# Altium schematic sheet USER_INTERFACE_input.SchDoc
size A; SheetNumber: 18; SheetTotal: 31
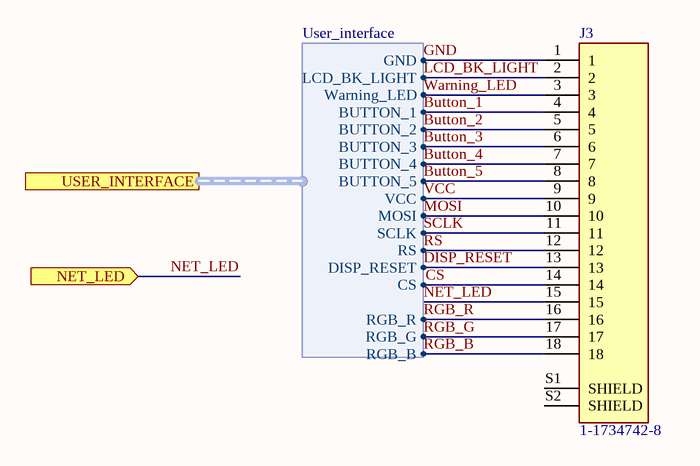
[diagram p0: USER_INTERFACE_input.SchDoc]

## Parts
J3  1-1734742-8  [FPC_SMD_18P_P0.5_vertical]

## Ports
NET_LED (in), USER_INTERFACE (harness User_interface)

## Harnesses
User_interface: GND, BUTTON_1, BUTTON_2, BUTTON_3, BUTTON_4, BUTTON_5, VCC, MOSI, SCLK, RS, DISP_RESET, CS, LCD_BK_LIGHT, Warning_LED, RGB_R, RGB_G, RGB_B

## Nets
Button_1: J3.4 ; port USER_INTERFACE.BUTTON_1
Button_2: J3.5 ; port USER_INTERFACE.BUTTON_2
Button_3: J3.6 ; port USER_INTERFACE.BUTTON_3
Button_4: J3.7 ; port USER_INTERFACE.BUTTON_4
Button_5: J3.8 ; port USER_INTERFACE.BUTTON_5
CS: J3.14 ; port USER_INTERFACE.CS
DISP_RESET: J3.13 ; port USER_INTERFACE.DISP_RESET
GND: J3.1 ; port USER_INTERFACE.GND
LCD_BK_LIGHT: J3.2 ; port USER_INTERFACE.LCD_BK_LIGHT
MOSI: J3.10 ; port USER_INTERFACE.MOSI
NET_LED: J3.15 ; port NET_LED
RGB_B: J3.18 ; port USER_INTERFACE.RGB_B
RGB_G: J3.17 ; port USER_INTERFACE.RGB_G
RGB_R: J3.16 ; port USER_INTERFACE.RGB_R
RS: J3.12 ; port USER_INTERFACE.RS
SCLK: J3.11 ; port USER_INTERFACE.SCLK
VCC: J3.9 ; port USER_INTERFACE.VCC
Warning_LED: J3.3 ; port USER_INTERFACE.Warning_LED

Not connected (* = marked no-connect by the designer): J3 S1(SHIELD) S2(SHIELD)

## Library data of the parts
J3 = 1-1734742-8: 18 Position FFC, FPC Connector Contacts, Vertical - 1 Sided 0.020" (0.50mm) Surface Mount; Manufacturer: TE Connectivity; Package: 0.05mm; Datasheet: https://www.te.com/commerce/DocumentDelivery/DDEController?Action=srchrtrv&DocNm=1734742&DocType=Customer+Drawing&DocLang=English; MPN: 1-1734742-8; Operating Temperature: -20°C ~ 85°C; LCSC: C5163208